# EAGLE design PCB Potencia con IC_v4 (EAGLE 9.6.2)
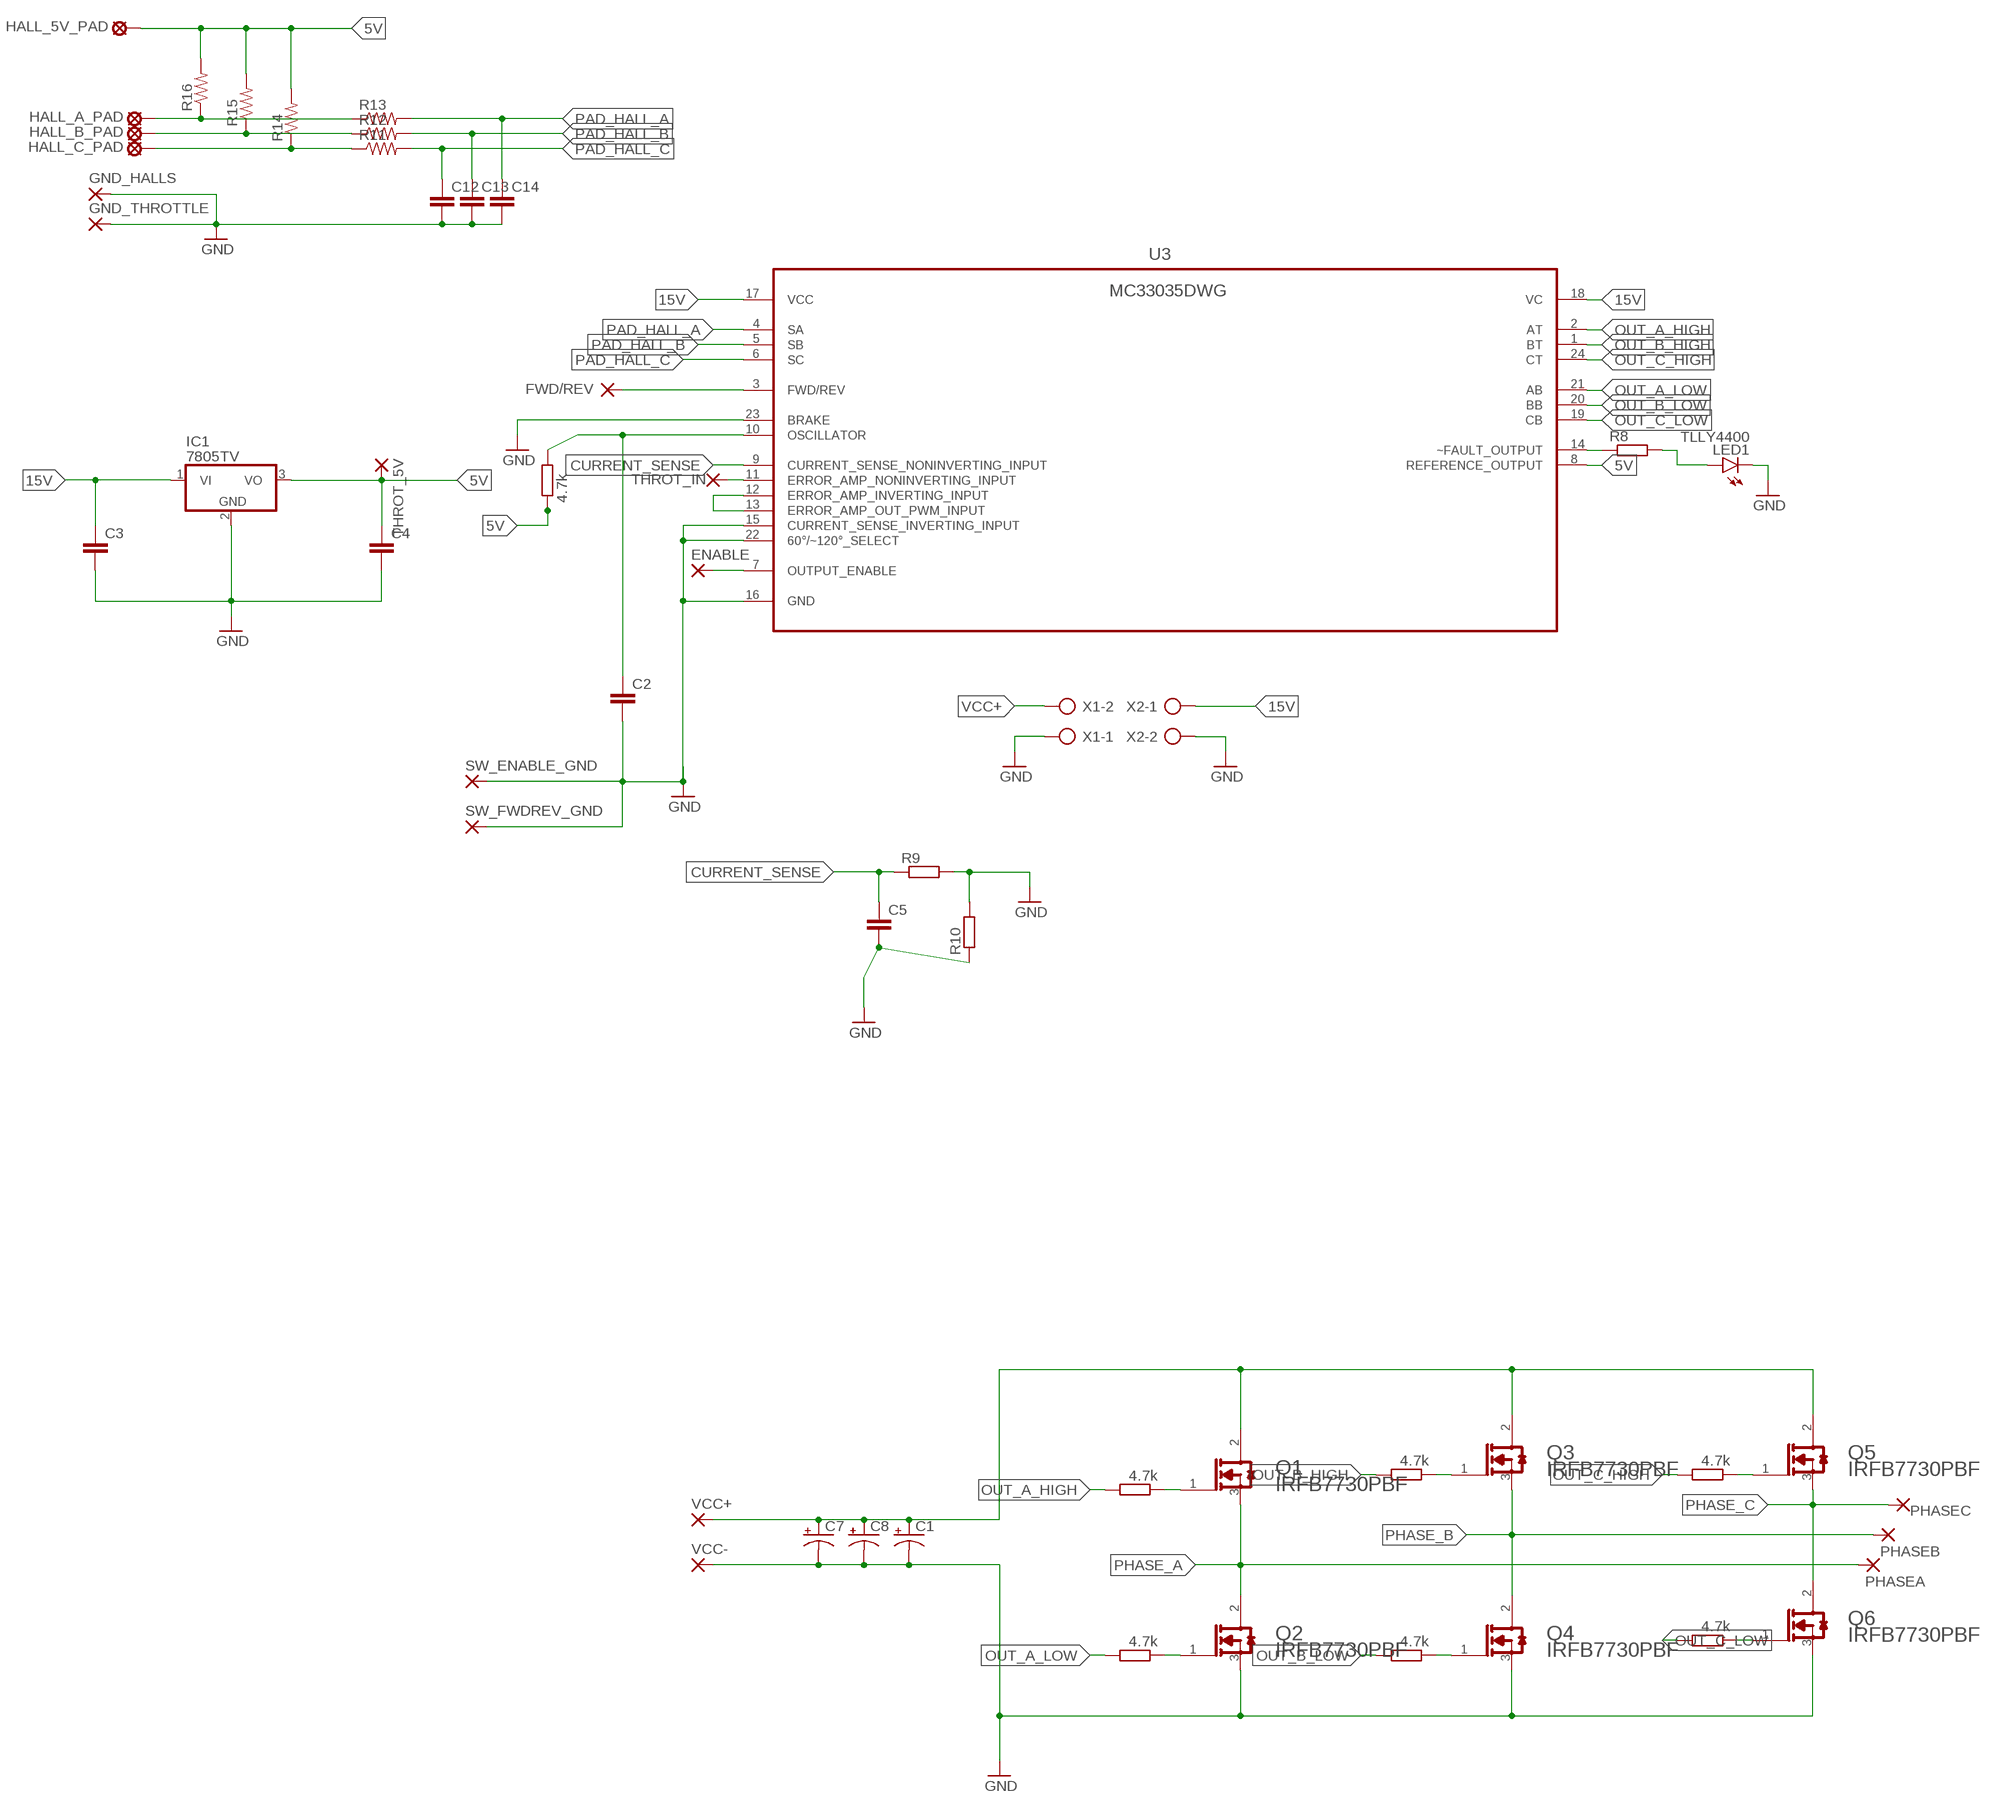
[diagram p0: schematic, sheet 1]

## Parts
C1  CPOL-USTT5D11  [TT5D11]
C2  C-EU025-030X050  [C025-030X050]
C3  C-EU025-030X050  [C025-030X050]
C4  C-EU025-030X050  [C025-030X050]
C5  C-EU025-030X050  [C025-030X050]
C7  CPOL-USTT5D11  [TT5D11]
C8  CPOL-USTT5D11  [TT5D11]
C12  C-EU025-030X050  [C025-030X050]
C13  C-EU025-030X050  [C025-030X050]
C14  C-EU025-030X050  [C025-030X050]
ENABLE  3,81/1,1  [3,81/1,1]
FWD/REV  3,81/1,4  [3,81/1,4]
GND_HALLS  3,81/1,1  [3,81/1,1]
GND_THROTTLE  3,81/1,1  [3,81/1,1]
HALL_5V_PAD  MCS08  [MCS08]
HALL_A_PAD  MCS08  [MCS08]
HALL_B_PAD  MCS08  [MCS08]
HALL_C_PAD  MCS08  [MCS08]
IC1  7805TV  [TO220V]
LED1  TLLY4400  [LED3MM]
PHASEA  3,81/1,4  [3,81/1,4]
PHASEB  3,81/1,4  [3,81/1,4]
PHASEC  3,81/1,4  [3,81/1,4]
Q1  INFINEON_IRFB7730PBFINFINEON_IRFB7730PBF_0_0  [INFINEON_IRFB7730PBF_0]
Q2  INFINEON_IRFB7730PBFINFINEON_IRFB7730PBF_0_0  [INFINEON_IRFB7730PBF_0]
Q3  INFINEON_IRFB7730PBFINFINEON_IRFB7730PBF_0_0  [INFINEON_IRFB7730PBF_0]
Q4  INFINEON_IRFB7730PBFINFINEON_IRFB7730PBF_0_0  [INFINEON_IRFB7730PBF_0]
Q5  INFINEON_IRFB7730PBFINFINEON_IRFB7730PBF_0_0  [INFINEON_IRFB7730PBF_0]
Q6  INFINEON_IRFB7730PBFINFINEON_IRFB7730PBF_0_0  [INFINEON_IRFB7730PBF_0]
R1  4.7k  R-EU_0207/10  [0207/10]
R2  4.7k  R-EU_0207/10  [0207/10]
R3  4.7k  R-EU_0207/10  [0207/10]
R4  4.7k  R-EU_0207/10  [0207/10]
R5  4.7k  R-EU_0207/10  [0207/10]
R6  4.7k  R-EU_0207/10  [0207/10]
R7  4.7k  R-EU_0207/10  [0207/10]
R8  R-EU_0207/10  [0207/10]
R9  R-EU_0207/10  [0207/10]
R10  R-EU_0207/10  [0207/10]
R11  R-US_0204/7  [0204/7]
R12  R-US_0204/7  [0204/7]
R13  R-US_0204/7  [0204/7]
R14  R-US_0204/7  [0204/7]
R15  R-US_0204/7  [0204/7]
R16  R-US_0204/7  [0204/7]
SW_ENABLE_GND  3,81/1,4  [3,81/1,4]
SW_FWDREV_GND  3,81/1,4  [3,81/1,4]
THROT_5V  3,81/1,4  [3,81/1,4]
THROT_IN  3,81/1,4  [3,81/1,4]
U3  MC33035DWG  [SOIC127P1030X265-24N]
VCC+  3,81/1,4  [3,81/1,4]
VCC-  3,81/1,4  [3,81/1,4]
X1  AK500/2-H  [AK500/2-H]
X2  AK500/2-H  [AK500/2-H]

## Nets
5V: C4.1 HALL_5V_PAD.MP IC1.3(VO) R7.1 R14.2 R15.2 R16.2 THROT_5V.1(P) U3.8(REFERENCE_OUTPUT)
15V: U3.17(VCC) U3.18(VC) X2.1
CURRENT_SENSE: U3.9(CURRENT_SENSE_NONINVERTING_INPUT)
GND: C1.- C2.2 C3.2 C4.2 C5.2 C7.- C8.- C12.2 C13.2 C14.2 GND_HALLS.1(P) GND_THROTTLE.1(P) IC1.2(GND) LED1.K(C) Q2.3(S) Q4.3(S) Q6.3(S) R9.2 R10.1 R10.2 SW_ENABLE_GND.1(P) SW_FWDREV_GND.1(P) U3.15(CURRENT_SENSE_INVERTING_INPUT) U3.16(GND) U3.22(60°/~120°_SELECT) U3.23(BRAKE) VCC-.1(P) X1.1 X2.2
N$1: C1.+ C7.+ C8.+ Q1.2(D) Q3.2(D) Q5.2(D) VCC+.1(P)
N$2: Q1.1(G) R1.1
N$3: FWD/REV.1(P) U3.3(FWD/REV)
N$4: ENABLE.1(P) U3.7(OUTPUT_ENABLE)
N$6: Q2.1(G) R2.1
N$7: Q3.1(G) R3.1
N$8: Q4.1(G) R4.1
N$9: Q5.1(G) R5.1
N$10: Q6.1(G) R6.1
N$11: U3.12(ERROR_AMP_INVERTING_INPUT) U3.13(ERROR_AMP_OUT_PWM_INPUT)
N$19: C3.1 IC1.1(VI)
N$20: R8.1 U3.14(~FAULT_OUTPUT)
N$21: THROT_IN.1(P) U3.11(ERROR_AMP_NONINVERTING_INPUT)
N$24: C2.1 R7.2 U3.10(OSCILLATOR)
N$25: LED1.A R8.2
N$27: C5.1 R9.1
N$29: HALL_A_PAD.MP R13.1 R16.1
N$32: HALL_B_PAD.MP R12.1 R15.1
N$33: HALL_C_PAD.MP R11.1 R14.1
OUT_A_HIGH: R1.2 U3.2(AT)
OUT_A_LOW: R2.2 U3.21(AB)
OUT_B_HIGH: R3.2 U3.1(BT)
OUT_B_LOW: R4.2 U3.20(BB)
OUT_C_HIGH: R5.2 U3.24(CT)
OUT_C_LOW: R6.2 U3.19(CB)
PAD_HALL_A: C14.1 R13.2 U3.4(SA)
PAD_HALL_B: C13.1 R12.2 U3.5(SB)
PAD_HALL_C: C12.1 R11.2 U3.6(SC)
PHASE_A: PHASEA.1(P) Q1.3(S) Q2.2(D)
PHASE_B: PHASEB.1(P) Q3.3(S) Q4.2(D)
PHASE_C: PHASEC.1(P) Q5.3(S) Q6.2(D)
VCC+: X1.2

## Library data of the parts
C1 C7 C8 = rcl:CPOL-US: POLARIZED CAPACITOR, American symbol; SPICEPREFIX: C
C2-C5 C12-C14 = rcl:C-EU: CAPACITOR, European symbol; SPICEPREFIX: C
ENABLE GND_HALLS GND_THROTTLE = wirepad:3,81/1,1: THROUGH-HOLE PAD
FWD/REV PHASEA PHASEB PHASEC SW_ENABLE_GND SW_FWDREV_GND THROT_5V THROT_IN VCC+ VCC- = wirepad:3,81/1,4: THROUGH-HOLE PAD
HALL_5V_PAD HALL_A_PAD HALL_B_PAD HALL_C_PAD = solpad:MCS08: SOLDER PAD MC S0,8, drill 1.2 mm, distributor Buerklin, 08F130
IC1 = linear:78*: Positive VOLTAGE REGULATOR Source: http://cache.national.com/ds/LM/LM78L05.pdf http://www.fairchildsemi.com/ds/LM/LM7805.pdf
LED1 = led:TLLY4400: Low Current (2mA) LED 3 mm Tinted Diffused Package color YELLOW Source: Data sheet <http://www.farnell.com/datasheets/391098.pdf>; MF: VISHAY SEMICONDUCTOR; OC_FARNELL: 1612439
Q1-Q6 = Infineon - IRFB7730PBF:INFINEON_IRFB7730PBF: N-Channel 75V 195A (Tc) 375W (Tc) Through Hole TO-220AB; AUTOMOTIVE: No; CENTROID_NOT_SPECIFIED: No; CONTINUOUS_DRAIN_CURRENT: 195A; DATASHEET: https://www.infineon.com/dgdl/irfs7730pbf.pdf?fileId=5546d462533600a40153563aad5921dc; DEPLETION_MODE: False; DEVICE_CLASS_L1: Discrete Semiconductors; DEVICE_CLASS_L2: Transistors; DEVICE_CLASS_L3: MOSFETs; DIGIKEY_DESCRIPTION: MOSFET N-CH 75V 195A TO220; DIGIKEY_PART_NUMBER: IRFB7730PBF-ND; DRAIN_TO_SOURCE_BREAKDOWN_VOLTAGE: 75V; DRAIN_TO_SOURCE_RESISTANCE: 2.2mΩ; DRAIN_TO_SOURCE_VOLTAGE: 75V; FOOTPRINT_PARAMETERS_0: {"fp_type":"TO220","params":{"N":{"long name":"Number of leads","type":"fixed","short name":"N","value":3},"A":{"nom":false,"long name":"Total height","min":15800000,"max":16129999,"short name":"A","type":"measurement"},"A1":{"nom":false,"long name":"Package clearance","min":3370000,"max":3670000,"short name":"A1","type":"measurement"},"D":{"nom":false,"long name":"Package length","min":false,"max":10750000,"short name":"D","type":"measurement"},"E":{"nom":false,"long name":"Package width","min":false,"max":4830000,"short name":"E","type":"measurement"},"B":{"nom":false,"long name":"Lead width","min":610000,"max":940000,"short name":"B","type":"measurement"},"C":{"nom":false,"long name":"Lead thickness","min":330000,"max":630000,"short name":"C","type":"measurement"},"e":{"nom":2540000,"long name":"Lead pitch","min":null,"max":null,"short name":"e","type":"measurement"},"offset x":{"nom":0,"long name":"X Center offset","min":null,"max":null,"short name":"offset x","type":"measurement"},"offset y":{"nom":0,"long name":"Y Center offset","min":null,"max":null,"short name":"offset y","type":"measurement"},"LS":{"default":"Circle","long name":"Land shape","type":"multichoice","short name":"LS"},"LS1":{"default":"Square","long name":"Land shape (Pin 1)","type":"multichoice","short name":"LS1"}}}; FOOTPRINT_URL: https://www.infineon.com/dgdl/po-to220ab-fp.pdf?fileId=5546d462580663ef0158068cfbee01be; FOOTPRINT_VARIANT_NAME_0: Recommended_Land_Pattern; GATE_CHARGE_AT_VGS: 271nC @ 10V; GATE_TO_SOURCE_VOLTAGE: 20V; HEIGHT: 19.8mm; INPUT_CAPACITACE_AT_VDS: 13660pF @ 25V; IPC_LAND_PATTERN_NAME: TO-220; LEAD_FREE: Yes; MAX_FORWARD_DIODE_VOLTAGE: 1.2V; MAX_JUNCTION_TEMP: +175°C; MF: Infineon; MFG_PACKAGE_IDENT: PG-TO220-3; MFG_PACKAGE_IDENT_COMPONENT_ID: 802d71249bb95e7c; MFG_PACKAGE_IDENT_DATE: 02/2008; MFG_PACKAGE_IDENT_REV: 904; MOUSER_PART_NUMBER: 942-IRFB7730PBF; MPN: IRFB7730PBF; NUMBER_OF_CHANNELS: 1; NUMBER_OF_N_CHANNELS: 1; PACKAGE: TO-220AB; POWER_DISSIPATION: 375W; PREFIX: Q; PULSE_DRAIN_CURRENT: 984A; REVERSE_RECOVERY_CHARGE: 70nC; REVERSE_RECOVERY_TIME: 44ns; ROHS: Yes; RTHJA_MAX: 62°C/W; STANDOFF_HEIGHT: 3.37mm; TECHNOLOGY: MOSFET; TEMPERATURE_RANGE_HIGH: +175°C; TEMPERATURE_RANGE_LOW: -55°C; THRESHOLD_VGS: 2.1V; THRESHOLD_VGS_MAX: 3.7V; THRESHOLD_VGS_MIN: 2.1V; TURN_OFF_DELAY_TIME: 180ns; TURN_ON_DELAY_TIME: 21ns; VERIFICATION_VERSION: 0.0.0.3
R1-R10 = rcl:R-EU_: RESISTOR, European symbol; SPICEPREFIX: R
R11-R16 = rcl:R-US_: RESISTOR, American symbol; SPICEPREFIX: R
U3 = MC33035DWG:MC33035DWG: Brushless DC Motor Controller Check availability <https://pricing.snapeda.com/parts/MC33035DWG/ON%20Semiconductor/view-part?ref=eda>; AVAILABILITY: In Stock; DESCRIPTION: - Motor Driver - Analog 24-SOIC; MF: ON Semiconductor; MP: MC33035DWG; PACKAGE: SOIC-24 ON Semiconductor; PRICE: None; PURCHASE-URL: https://pricing.snapeda.com/search/part/MC33035DWG/?ref=eda
X1 X2 = con-ptr500:AK500/2-H: CONNECTOR Aug. 2004 / PTR Meßtechnik: Die Bezeichnung der Serie AK505 wurde geändert. Es handelt sich hierbei um AK500 in horizontaler Ausführung.; OC_FARNELL: unknown; OC_NEWARK: unknown

## Board
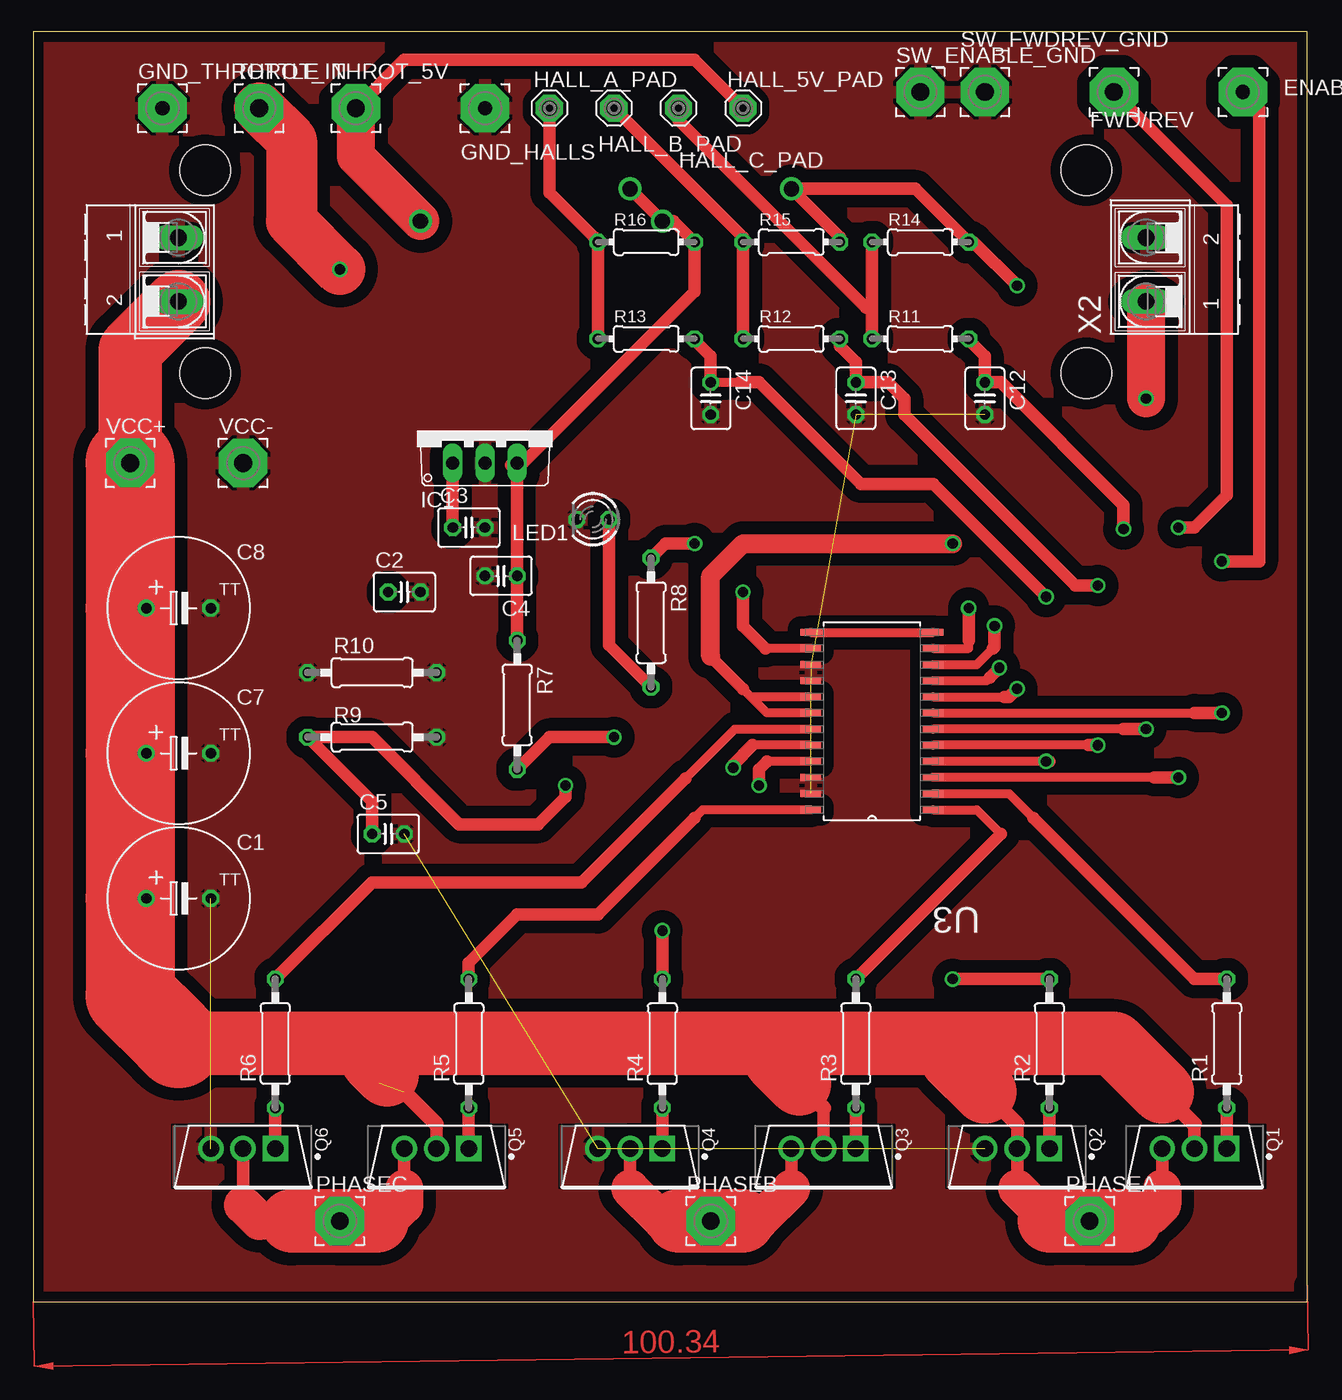
[diagram p1: board, top side]
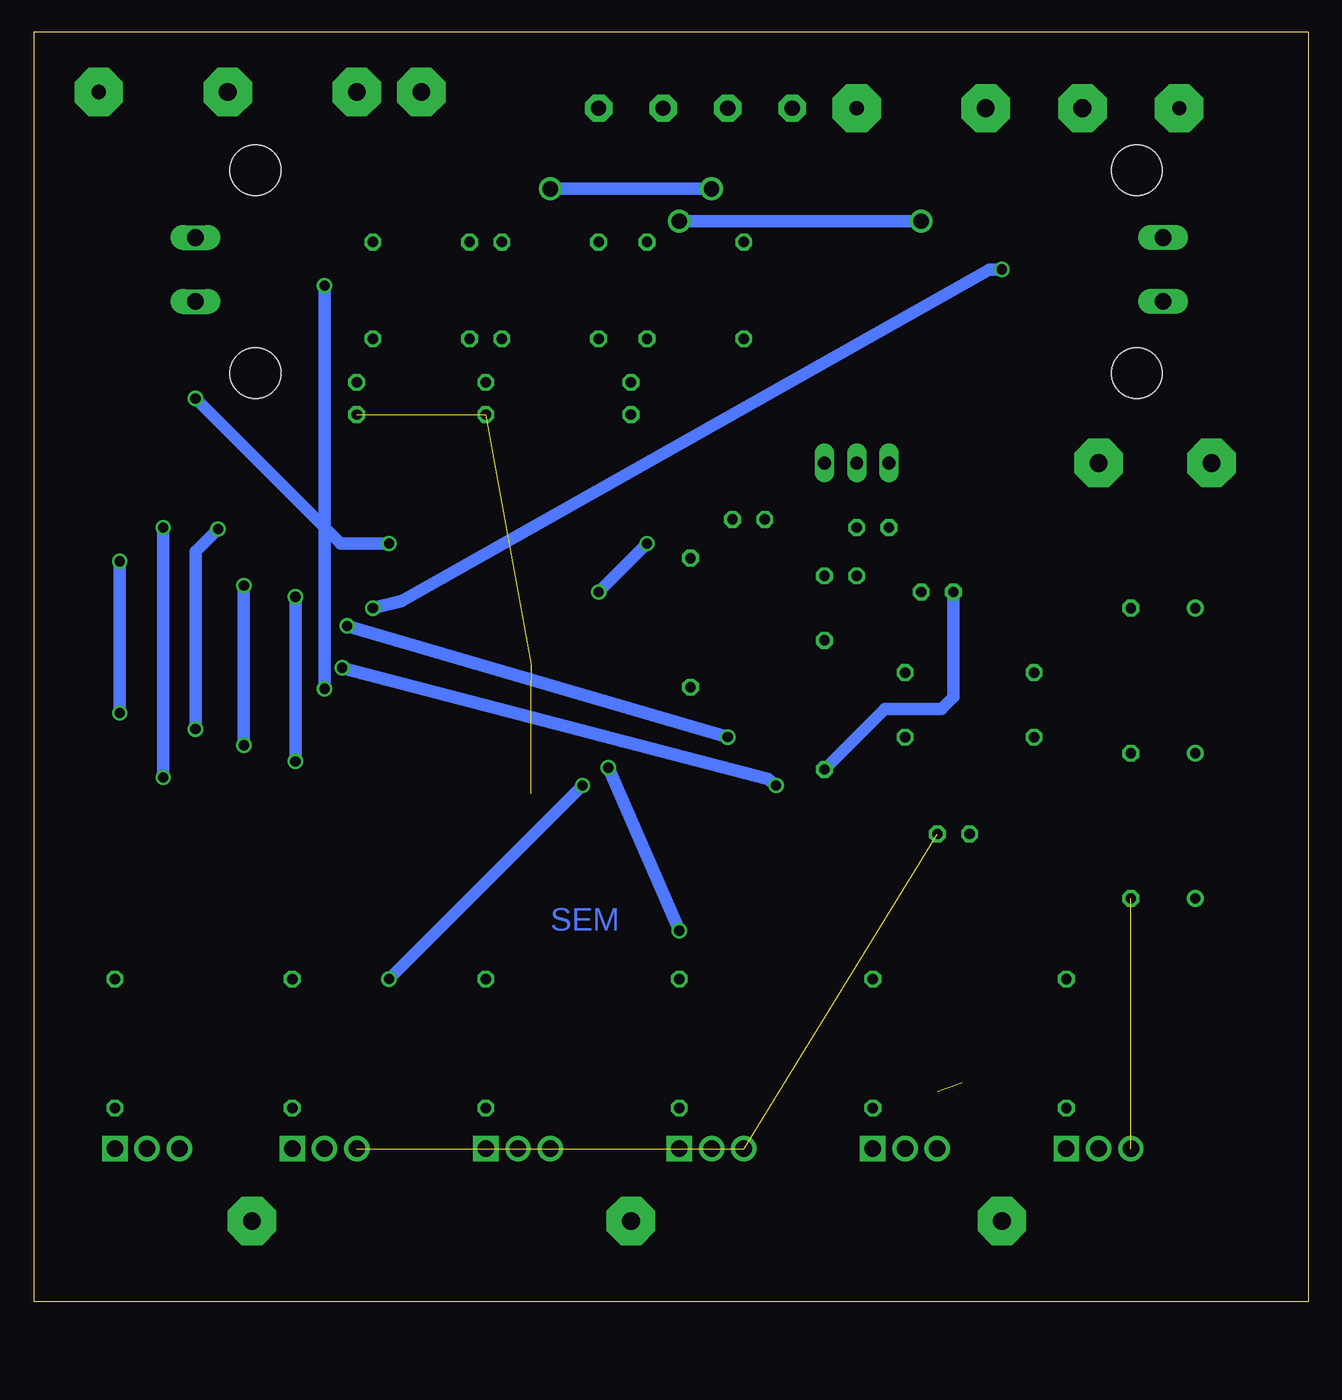
[diagram p2: board, bottom side, seen from below]

Size 100.31 x 100 mm. Coordinates in mm from the lower left corner, seen from the top.
Outline: 0,0 100.31,0 100.31,100 0,100 0,0
Copper layers (1*16): Top 0.035mm / dielectric 1.5mm / Bottom 0.035mm
Design rules "default *": minimum track width 1mm, minimum drill 0.8mm, track to track 1mm, track to pad 1mm, pad to pad 6mil, via to via 6mil, smd to smd 6mil, copper to edge 0.8mm, drill to drill 6mil, minimum pad ring 10mil, minimum via ring 8mil, stop-mask expansion 4mil, vias tented up to drill 0mil, thermal gap 10mil
Holes 4 mm at 13.51,73.1 13.51,89.1 82.91,73.1 82.91,89.1

### Footprints (pad centres in the part's own frame; a part is rotated, then mirrored left to right if it is on the bottom)
TT5D11 = drill 0.813: + -2.54,0 | drill 0.813 octagon: - 2.54,0
C025-030X050 = drill 0.813 octagon: 1 -1.27,0; 2 1.27,0
3,81/1,1 = drill 1.118 pad 3.81 octagon: 1 0,0
3,81/1,4 = drill 1.397 pad 3.81 octagon: 1 0,0
MCS08 = drill 1.194 pad 2.159 octagon: MP 0,0
TO220V = drill 1.016 long: 1 -2.54,-2.54; 2 0,-2.54; 3 2.54,-2.54
LED3MM = drill 0.813 octagon: A -1.27,0; K 1.27,0
INFINEON_IRFB7730PBF_0 = drill 1.3 pad 2 square: 1 -0.61,2.54 | drill 1.3 pad 2: 2 -0.61,0; 3 -0.61,-2.54
0207/10 = drill 0.813 octagon: 1 -5.08,0; 2 5.08,0
0204/7 = drill 0.813 octagon: 1 -3.81,0; 2 3.81,0
SOIC127P1030X265-24N = smd 1.6 x 0.533: 1 -4.826,6.985; 2 -4.826,5.715; 3 -4.826,4.445; 4 -4.826,3.175; 5 -4.826,1.905; 6 -4.826,0.635; 7 -4.826,-0.635; 8 -4.826,-1.905; 9 -4.826,-3.175; 10 -4.826,-4.445; 11 -4.826,-5.715; 12 -4.826,-6.985; 13 4.826,-6.985; 14 4.826,-5.715; 15 4.826,-4.445; 16 4.826,-3.175; 17 4.826,-1.905; 18 4.826,-0.635; 19 4.826,0.635; 20 4.826,1.905; 21 4.826,3.175; 22 4.826,4.445; 23 4.826,5.715; 24 4.826,6.985
AK500/2-H = drill 1.321 long: 1 -2.515,0; 2 2.515,0

### Placement (x,y rotation side)
C1  11.43,31.75 0 top
C2  29.21,55.88 0 top
C3  34.29,60.96 0 top
C4  36.83,57.15 180 top
C5  27.94,36.83 0 top
C7  11.43,43.18 0 top
C8  11.43,54.61 0 top
C12  74.93,71.12 270 top
C13  64.77,71.12 270 top
C14  53.34,71.12 270 top
ENABLE  95.25,95.25 0 top
FWD/REV  85.09,95.25 0 top
GND_HALLS  35.56,93.98 0 top
GND_THROTTLE  10.16,93.98 0 top
HALL_5V_PAD  55.88,93.98 0 top
HALL_A_PAD  40.64,93.98 0 top
HALL_B_PAD  45.72,93.98 0 top
HALL_C_PAD  50.8,93.98 0 top
IC1  35.56,68.58 0 top
LED1  44.07,61.59 180 top
PHASEA  83.19,6.35 0 top
PHASEB  53.34,6.35 0 top
PHASEC  24.13,6.35 0 top
Q1  91.44,11.43 270 top
Q2  77.47,11.43 270 top
Q3  62.23,11.43 270 top
Q4  46.99,11.43 270 top
Q5  31.75,11.43 270 top
Q6  16.51,11.43 270 top
R1  93.98,20.32 90 top
R2  80.01,20.32 90 top
R3  64.77,20.32 90 top
R4  49.53,20.32 90 top
R5  34.29,20.32 90 top
R6  19.05,20.32 90 top
R7  38.1,46.99 270 top
R8  48.64,53.47 270 top
R9  26.67,44.45 0 top
R10  26.67,49.53 0 top
R11  69.85,75.82 0 top
R12  59.69,75.82 0 top
R13  48.26,75.82 0 top
R14  69.85,83.44 0 top
R15  59.69,83.44 0 top
R16  48.26,83.44 0 top
SW_ENABLE_GND  69.85,95.25 0 top
SW_FWDREV_GND  74.93,95.25 0 top
THROT_5V  25.4,93.98 0 top
THROT_IN  17.78,93.98 0 top
U3  66.04,45.72 180 top
VCC+  7.62,66.04 0 top
VCC-  16.51,66.04 0 top
X1  11.43,81.28 270 top
X2  87.63,81.28 90 top

### Tracks (layer width: path | path; a pad name or v marks a point on that pad's centre or on a via)
5V  (via drill 0.8, 1.2)
  Top 0.7: U3.8 76.45,47.62
  Top 1: R7.1 C4.1 IC1.3 37.62,65.88 38.42,65.88 52.07,79.53 R16.2 50.42,85.09 v49.53,85.09 v46.99,87.63 | THROT_5V.1 29.21,97.79 52.07,97.79 HALL_5V_PAD.MP | R15.2 63.5,83.82 v59.69,87.63 69.47,87.63 R14.2 74.04,83.44 v77.47,80.01 | 76.45,47.62 76.83,47.62 v77.47,48.26
  Top 3: v30.48,85.09 25.4,90.17 THROT_5V.1
  Bottom 1: v49.53,85.09 v30.48,85.09 | v46.99,87.63 v59.69,87.63 | v77.47,48.26 v77.47,80.01
15V  (via drill 0.8)
  Top 0.7: U3.17 56.52,47.62 | 56.52,47.62 55.88,48.26 | U3.18 57.78,46.35 56.52,47.62
  Top 1: 55.88,48.26 53.34,50.8
  Top 1.5: 53.34,50.8 53.34,57.15 55.88,59.69 v72.39,59.69
  Top 3: v87.63,71.12 X2.1
  Bottom 1: v72.39,59.69 76.2,59.69 v87.63,71.12
CURRENT_SENSE  (via drill 0.8)
  Top 0.7: 75.31,49.15 75.06,48.9 U3.9
  Top 1: 21.59,44.45 26.67,44.45 33.53,37.59 39.75,37.59 41.91,39.75 v41.91,40.64 | 75.31,49.15 v76.07,49.91
  Bottom 1: v76.07,49.91 42.55,41.15 v41.91,40.64
GND  (8 unrouted)
  pour Top: 0,100.33 0,0 100.33,0 100.33,100.33
N$1  (1 unrouted)
  Top 1: Q5.2 31.75,13.97 | Q3.2 62.23,15.24 | Q1.2 91.44,13.97 | C1.+ 7.62,31.75 | 10.95,20.8 12.38,22.23 13.97,20.32 | C7.+ 7.62,43.18 | C8.+ 7.62,54.61 | 59.37,18.1 59.37,20.32 | 27.23,17.22 27.86,17.86 27.94,17.94 27.94,20.32
  Top 1.2: 31.75,13.97 29.21,16.51 | 62.23,15.24 60.33,17.14 59.69,17.78 | 91.44,13.97 88.9,16.51
  Top 5: 13.97,20.32 27.94,20.32 59.37,20.32 85.09,20.32 88.9,16.51 | 27.86,17.86 26.67,19.05 | 60.33,17.14 59.37,18.1 58.42,19.05 | VCC+.1 7.62,74.93 11.43,78.74
  Top 7: VCC+.1 7.62,54.61 7.62,43.18 7.62,31.75 7.62,24.13 10.95,20.8 11.43,20.32
N$2
  Top 1: Q1.1 R1.1
N$3  (via drill 0.8)
  Top 0.7: 88.27,41.27 U3.3
  Top 1: FWD/REV.1 93.98,86.36 93.98,63.5 91.44,60.96 v90.17,60.96 | v90.17,41.27 88.27,41.27
  Bottom 1: v90.17,60.96 v90.17,41.27
N$4  (via drill 0.8)
  Top 0.7: U3.7 91.44,46.35
  Top 1: ENABLE.1 96.52,93.98 96.52,58.29 v93.6,58.29 | 91.44,46.35 v93.6,46.35
  Bottom 1: v93.6,58.29 v93.6,46.35
N$6
  Top 1: Q2.1 R2.1
N$7
  Top 1: Q3.1 R3.1
N$8
  Top 1: Q4.1 R4.1
N$9
  Top 1: Q5.1 R5.1
N$10
  Top 1: R6.1 Q6.1
N$11
  Top 0.7: U3.13 U3.12
N$19
  Top 1: IC1.1 C3.1
N$20  (via drill 0.8)
  Top 0.7: U3.14 57.66,51.44
  Top 1: R8.1 49.78,59.69 v52.07,59.69 | v55.88,55.88 55.88,53.21 57.66,51.44
  Bottom 1: v52.07,59.69 v55.88,55.88
N$21  (via drill 0.8)
  Top 0.7: U3.11 73.66,51.44 73.66,52.07
  Top 1: 73.66,52.07 v73.66,54.61
  Top 4: THROT_IN.1 20.32,91.44 20.32,85.09 v24.13,81.28
  Bottom 1: v73.66,54.61 71.4,55.17 25.11,81.28 v24.13,81.28
N$24  (via drill 0.8)
  Top 0.7: U3.10 74.3,50.16 75.56,51.44
  Top 1: 75.56,51.44 75.69,51.56 v75.69,53.21 | v45.72,44.45 40.64,44.45 R7.2
  Bottom 1: C2.1 27.94,47.62 28.89,46.67 33.34,46.67 R7.2 | v75.69,53.21 v45.72,44.45
N$25
  Top 1: LED1.A 45.34,51.69 R8.2
N$27
  Top 1: C5.1 26.67,39.37 R9.1
N$29
  Top 1: R13.1 R16.1 44.13,83.82 40.64,87.31 HALL_A_PAD.MP
N$32
  Top 1: R12.1 R15.1 55.88,83.82 HALL_B_PAD.MP
N$33
  Top 1: R14.1 66.04,78.26 | 66.04,78.26 R11.1 | HALL_C_PAD.MP 50.8,93.03 65.56,78.26 66.04,78.26
OUT_A_HIGH
  Top 0.7: U3.2 76.83,40.01 78.74,38.1
  Top 1: 78.74,38.1 91.44,25.4 R1.2
OUT_A_LOW  (via drill 0.8)
  Top 0.7: U3.21 57.78,42.55
  Top 1: 57.78,42.55 57.15,41.91 v57.15,40.64 | v72.39,25.4 R2.2
  Bottom 1: v57.15,40.64 v72.39,25.4
OUT_B_HIGH
  Top 0.7: U3.1 74.3,38.73 76.2,36.83
  Top 1: 76.2,36.83 R3.2
OUT_B_LOW  (via drill 0.8)
  Top 0.7: U3.20 56.64,43.81
  Top 1: 56.64,43.81 55.12,42.29 v55.12,42.04 | v49.53,29.21 R4.2
  Bottom 1: v55.12,42.04 v49.53,29.21
OUT_C_HIGH
  Top 0.7: U3.24 52.7,38.73 52.07,38.1
  Top 1: 52.07,38.1 44.45,30.48 38.1,30.48 34.29,26.67 R5.2
OUT_C_LOW
  Top 0.7: 51.36,41.2 55.24,45.09 U3.19
  Top 1: R6.2 26.67,33.02 43.18,33.02 51.36,41.2
PAD_HALL_A  (via drill 0.8)
  Top 0.7: C14.1 55.7,72.39 | 80.01,42.55 U3.4
  Top 1: C14.1 53.34,74.45 52.07,75.72 R13.2 | 55.7,72.39 57.15,72.39 65.15,64.39 70.87,64.39 v79.76,55.5 | 80.01,42.55 v79.76,42.55
  Bottom 1: v79.76,55.5 v79.76,42.55
PAD_HALL_B  (via drill 0.8)
  Top 0.7: 83.06,43.81 U3.5
  Top 1: R12.2 63.5,75.25 64.77,73.98 C13.1 67.31,72.39 68.58,71.12 68.58,69.85 82.04,56.39 v83.82,56.39 | v83.82,43.81 83.06,43.81
  Bottom 1: v83.82,56.39 v83.82,43.81
PAD_HALL_C  (via drill 0.8)
  Top 0.7: 86.36,45.09 U3.6
  Top 1: R11.2 73.66,75.72 74.93,74.45 C12.1 76.2,72.39 85.85,62.74 v85.85,60.83 | v87.63,45.09 86.36,45.09 85.85,45.09
  Bottom 1: v85.85,60.83 87.63,59.05 v87.63,45.09
PHASE_A
  Top 1: 77.47,8.89 Q2.2 77.47,13.97 | Q1.3 88.9,8.89 | 88.11,6.83 87.95,6.99 87.37,7.56 86.36,6.35 | 80.01,6.35 79.53,6.35 78.74,7.62
  Top 1.2: 77.47,13.97 74.93,16.51
  Top 3: 77.47,8.89 78.74,7.62 | 88.9,8.89 88.9,7.62 88.11,6.83 | 87.95,6.99 87.63,6.67
  Top 5: 80.01,6.35 PHASEA.1 86.36,6.35 | 74.93,16.51 72.39,19.05
PHASE_B
  Top 1: 46.99,8.89 Q4.2 | 59.69,8.89 Q3.3
  Top 3: 55.88,6.35 57.15,6.35 59.69,8.89 | 50.8,6.35 49.53,6.35 46.99,8.89
  Top 5: 50.8,6.35 PHASEB.1 55.88,6.35
PHASE_C
  Top 1: Q5.3 29.21,8.89 | Q6.2 16.51,7.62
  Top 3: 20.32,6.35 17.78,6.35 16.51,7.62 | 27.05,6.35 27.94,6.35 29.21,7.62 29.21,8.89
  Top 5: 20.32,6.35 PHASEC.1 27.05,6.35
(copper drawn outside any net)
  shapes: Top area x1

### Text on the board
Bottom: SEM